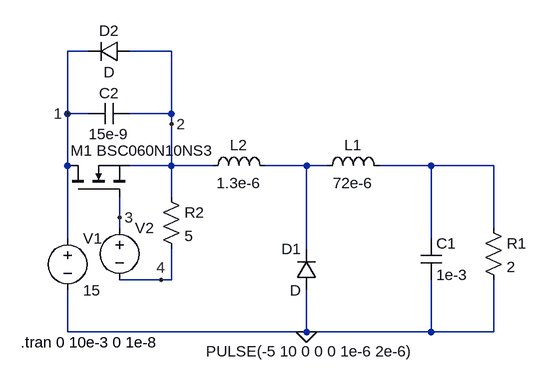
[diagram p0: schematic S7T2.asc]
S7T2.asc, the LTspice schematic file:
Version 4
SHEET 1 880 680
WIRE 32 -176 0 -176
WIRE 160 -176 96 -176
WIRE 0 -80 0 -176
WIRE 32 -80 0 -80
WIRE 160 -80 160 -176
WIRE 160 -80 96 -80
WIRE 160 -64 160 -80
WIRE 0 0 0 -80
WIRE 160 0 160 -64
WIRE 160 0 96 0
WIRE 224 0 160 0
WIRE 368 0 304 0
WIRE 400 0 368 0
WIRE 560 0 480 0
WIRE 656 0 560 0
WIRE 160 48 160 0
WIRE 80 80 80 48
WIRE 80 96 80 80
WIRE 656 96 656 0
WIRE 0 112 0 0
WIRE 560 112 560 0
WIRE 368 128 368 0
WIRE 144 176 80 176
WIRE 160 176 160 128
WIRE 160 176 144 176
WIRE 0 256 0 192
WIRE 368 256 368 192
WIRE 368 256 0 256
WIRE 560 256 560 176
WIRE 560 256 368 256
WIRE 656 256 656 176
WIRE 656 256 560 256
FLAG 368 256 0
FLAG 0 -80 1
FLAG 160 -64 2
FLAG 80 80 3
FLAG 144 176 4
SYMBOL voltage 0 96 R0
WINDOW 123 0 0 Left 0
WINDOW 39 0 0 Left 0
SYMATTR InstName V1
SYMATTR Value 15
SYMBOL diode 384 192 R180
WINDOW 0 24 64 Left 2
WINDOW 3 24 0 Left 2
SYMATTR InstName D1
SYMBOL ind 384 16 R270
WINDOW 0 32 56 VTop 2
WINDOW 3 5 56 VBottom 2
SYMATTR InstName L1
SYMATTR Value 72e-6
SYMBOL cap 544 112 R0
SYMATTR InstName C1
SYMATTR Value 1e-3
SYMBOL res 640 80 R0
SYMATTR InstName R1
SYMATTR Value 2
SYMBOL nmos 0 48 R270
WINDOW 0 71 5 VRight 2
WINDOW 3 71 45 VRight 2
SYMATTR InstName M1
SYMATTR Value BSC060N10NS3
SYMBOL voltage 80 80 R0
WINDOW 123 0 0 Left 0
WINDOW 39 0 0 Left 0
WINDOW 3 133 206 Left 2
SYMATTR Value PULSE(-5 10 0 0 0 1e-6 2e-6)
SYMATTR InstName V2
SYMBOL res 144 32 R0
SYMATTR InstName R2
SYMATTR Value 5
SYMBOL ind 208 16 R270
WINDOW 0 32 56 VTop 2
WINDOW 3 5 56 VBottom 2
SYMATTR InstName L2
SYMATTR Value 1.3e-6
SYMBOL cap 96 -96 R90
WINDOW 0 0 32 VBottom 2
WINDOW 3 32 32 VTop 2
SYMATTR InstName C2
SYMATTR Value 15e-9
SYMBOL diode 96 -192 R90
WINDOW 0 0 32 VBottom 2
WINDOW 3 32 32 VTop 2
SYMATTR InstName D2
TEXT -72 272 Left 2 !.tran 0 10e-3 0 1e-8

The netlist it stands for:
* S7T2.asc
V1 1 0 15
D1 0 N001 D
L1 N001 N002 72e-6
C1 N002 0 1e-3
R1 N002 0 2
M1 1 3 2 2 BSC060N10NS3
V2 3 4 PULSE(-5 10 0 0 0 1e-6 2e-6)
R2 2 4 5
L2 2 N001 1.3e-6
C2 2 1 15e-9
D2 2 1 D
.model D D
.lib standard.dio
.model NMOS NMOS
.model PMOS PMOS
.lib standard.mos
.tran 0 10e-3 0 1e-8
.backanno
.end